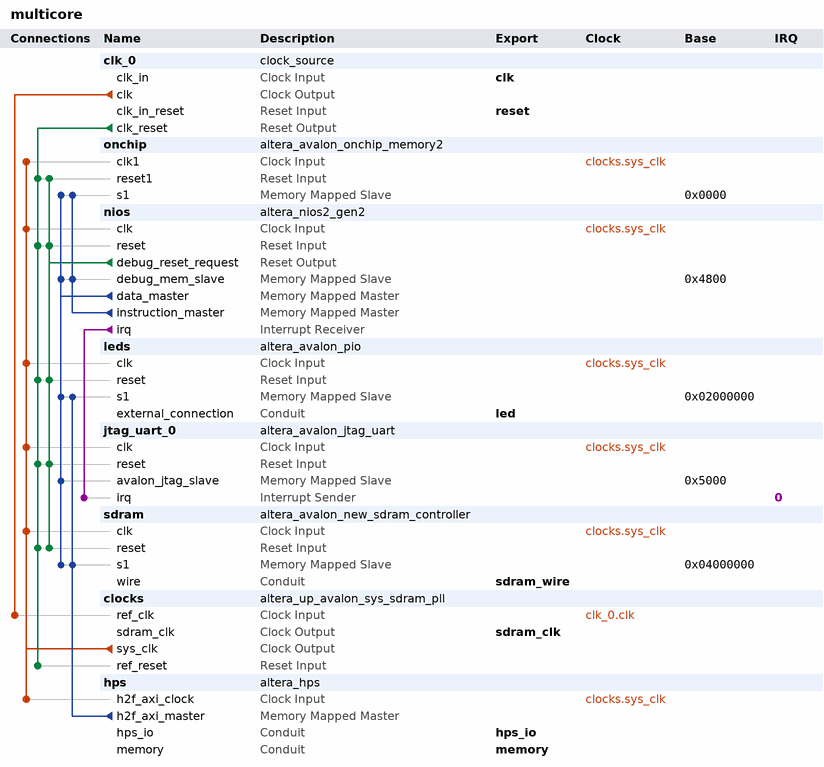
[diagram p0: system contents]
# Platform Designer (Qsys) system multicore, Cyclone V 5CSEMA5F31C6
# Parameters at their usual value, and those the tool derives, are not listed.
package require -exact qsys 16.1
create_system multicore
set_project_property DEVICE_FAMILY {Cyclone V}
set_project_property DEVICE 5CSEMA5F31C6

add_instance clk_0 clock_source 16.1
set_instance_parameter_value clk_0 clockFrequency 50000000

add_instance onchip altera_avalon_onchip_memory2 16.1
set_instance_parameter_value onchip dataWidth 32
set_instance_parameter_value onchip dualPort false
set_instance_parameter_value onchip initMemContent true
set_instance_parameter_value onchip initializationFileName onchip_mem.hex
set_instance_parameter_value onchip memorySize 16384

add_instance nios altera_nios2_gen2 16.1
set_instance_parameter_value nios dcache_size 2048
set_instance_parameter_value nios exceptionSlave onchip.s1
set_instance_parameter_value nios icache_size 4096
set_instance_parameter_value nios impl Tiny
set_instance_parameter_value nios resetSlave onchip.s1

add_instance leds altera_avalon_pio 16.1
set_instance_parameter_value leds direction Output
set_instance_parameter_value leds width 8

add_instance jtag_uart_0 altera_avalon_jtag_uart 16.1
set_instance_parameter_value jtag_uart_0 simInteractiveOptions NO_INTERACTIVE_WINDOWS

add_instance sdram altera_avalon_new_sdram_controller 16.1
set_instance_parameter_value sdram TAC 5.5
set_instance_parameter_value sdram TRCD 20.0
set_instance_parameter_value sdram TRP 20.0
set_instance_parameter_value sdram casLatency 3
set_instance_parameter_value sdram columnWidth 10
set_instance_parameter_value sdram dataWidth 16
set_instance_parameter_value sdram generateSimulationModel true
set_instance_parameter_value sdram model single_Micron_MT48LC4M32B2_7_chip
set_instance_parameter_value sdram numberOfBanks 4
set_instance_parameter_value sdram numberOfChipSelects 1
set_instance_parameter_value sdram powerUpDelay 100.0
set_instance_parameter_value sdram refreshPeriod 15.625
set_instance_parameter_value sdram rowWidth 13

add_instance clocks altera_up_avalon_sys_sdram_pll 16.1
set_instance_parameter_value clocks CV_boards DE1-SoC
set_instance_parameter_value clocks gui_outclk 50.0
set_instance_parameter_value clocks gui_refclk 50.0

add_instance hps altera_hps 16.1
set_instance_parameter_value hps CAN0_Mode CAN
set_instance_parameter_value hps CAN0_PinMuxing {HPS I/O Set 0}
set_instance_parameter_value hps EMAC1_Mode RGMII
set_instance_parameter_value hps EMAC1_PinMuxing {HPS I/O Set 0}
set_instance_parameter_value hps F2SCLK_COLDRST_Enable false
set_instance_parameter_value hps F2SCLK_DBGRST_Enable false
set_instance_parameter_value hps F2SCLK_WARMRST_Enable false
set_instance_parameter_value hps F2SINTERRUPT_Enable true
set_instance_parameter_value hps F2S_Width 0
set_instance_parameter_value hps FPGA_PERIPHERAL_OUTPUT_CLOCK_FREQ_EMAC0_GTX_CLK 125
set_instance_parameter_value hps FPGA_PERIPHERAL_OUTPUT_CLOCK_FREQ_EMAC0_MD_CLK 2.5
set_instance_parameter_value hps FPGA_PERIPHERAL_OUTPUT_CLOCK_FREQ_EMAC1_GTX_CLK 125
set_instance_parameter_value hps FPGA_PERIPHERAL_OUTPUT_CLOCK_FREQ_EMAC1_MD_CLK 2.5
set_instance_parameter_value hps HPS_PROTOCOL DDR3
set_instance_parameter_value hps I2C0_Mode I2C
set_instance_parameter_value hps I2C0_PinMuxing {HPS I/O Set 1}
set_instance_parameter_value hps I2C1_Mode N/A
set_instance_parameter_value hps I2C1_PinMuxing Unused
set_instance_parameter_value hps LWH2F_Enable false
set_instance_parameter_value hps MEM_BANKADDR_WIDTH 3
set_instance_parameter_value hps MEM_CLK_FREQ 400.0
set_instance_parameter_value hps MEM_COL_ADDR_WIDTH 10
set_instance_parameter_value hps MEM_DQ_WIDTH 40
set_instance_parameter_value hps MEM_DRV_STR RZQ/6
set_instance_parameter_value hps MEM_ROW_ADDR_WIDTH 15
set_instance_parameter_value hps MEM_RTT_NOM RZQ/6
set_instance_parameter_value hps MEM_RTT_WR {Dynamic ODT off}
set_instance_parameter_value hps MEM_TCL 7
set_instance_parameter_value hps MEM_TFAW_NS 30.0
set_instance_parameter_value hps MEM_TRAS_NS 35.0
set_instance_parameter_value hps MEM_TRCD_NS 13.75
set_instance_parameter_value hps MEM_TRFC_NS 260.0
set_instance_parameter_value hps MEM_TRP_NS 13.75
set_instance_parameter_value hps MEM_TRRD_NS 10.0
set_instance_parameter_value hps MEM_TRTP_NS 10.0
set_instance_parameter_value hps MEM_VENDOR JEDEC
set_instance_parameter_value hps MEM_WTCL 6
set_instance_parameter_value hps QSPI_Mode {1 SS}
set_instance_parameter_value hps QSPI_PinMuxing {HPS I/O Set 0}
set_instance_parameter_value hps REF_CLK_FREQ 25.0
set_instance_parameter_value hps S2FCLK_USER2CLK 5
set_instance_parameter_value hps S2F_Width 1
set_instance_parameter_value hps SDIO_Mode {4-bit Data}
set_instance_parameter_value hps SDIO_PinMuxing {HPS I/O Set 0}
set_instance_parameter_value hps SPIM0_Mode {Single Slave Select}
set_instance_parameter_value hps SPIM0_PinMuxing {HPS I/O Set 0}
set_instance_parameter_value hps SPIM1_Mode N/A
set_instance_parameter_value hps SPIM1_PinMuxing Unused
set_instance_parameter_value hps STM_Enable false
set_instance_parameter_value hps TIMING_BOARD_AC_SKEW 0.02
set_instance_parameter_value hps TIMING_BOARD_AC_TO_CK_SKEW 0.0
set_instance_parameter_value hps TIMING_BOARD_DQ_TO_DQS_SKEW 0.0
set_instance_parameter_value hps TIMING_BOARD_MAX_CK_DELAY 0.6
set_instance_parameter_value hps TIMING_BOARD_MAX_DQS_DELAY 0.6
set_instance_parameter_value hps TIMING_BOARD_SKEW_BETWEEN_DQS 0.02
set_instance_parameter_value hps TIMING_BOARD_SKEW_CKDQS_DIMM_MAX 0.01
set_instance_parameter_value hps TIMING_BOARD_SKEW_CKDQS_DIMM_MIN -0.01
set_instance_parameter_value hps TIMING_BOARD_SKEW_WITHIN_DQS 0.02
set_instance_parameter_value hps TIMING_TDH 45
set_instance_parameter_value hps TIMING_TDQSCK 225
set_instance_parameter_value hps TIMING_TDQSQ 100
set_instance_parameter_value hps TIMING_TDQSS 0.27
set_instance_parameter_value hps TIMING_TDS 10
set_instance_parameter_value hps TIMING_TDSH 0.18
set_instance_parameter_value hps TIMING_TDSS 0.18
set_instance_parameter_value hps TIMING_TIH 120
set_instance_parameter_value hps TIMING_TIS 170
set_instance_parameter_value hps TIMING_TQSH 0.4
set_instance_parameter_value hps TRACE_Mode HPS
set_instance_parameter_value hps TRACE_PinMuxing {HPS I/O Set 0}
set_instance_parameter_value hps UART0_Mode {No Flow Control}
set_instance_parameter_value hps UART0_PinMuxing {HPS I/O Set 2}
set_instance_parameter_value hps USB1_Mode SDR
set_instance_parameter_value hps USB1_PinMuxing {HPS I/O Set 0}
set_instance_parameter_value hps desired_cfg_clk_mhz 100.0
set_instance_parameter_value hps desired_qspi_clk_mhz 400.0

# connections
add_connection clk_0.clk clocks.ref_clk clock
add_connection clocks.sys_clk hps.h2f_axi_clock clock
add_connection clocks.sys_clk jtag_uart_0.clk clock
add_connection clocks.sys_clk leds.clk clock
add_connection clocks.sys_clk nios.clk clock
add_connection clocks.sys_clk onchip.clk1 clock
add_connection clocks.sys_clk sdram.clk clock
add_connection clk_0.clk_reset clocks.ref_reset reset
add_connection clk_0.clk_reset jtag_uart_0.reset reset
add_connection clk_0.clk_reset leds.reset reset
add_connection clk_0.clk_reset nios.reset reset
add_connection clk_0.clk_reset onchip.reset1 reset
add_connection clk_0.clk_reset sdram.reset reset
add_connection nios.debug_reset_request jtag_uart_0.reset reset
add_connection nios.debug_reset_request leds.reset reset
add_connection nios.debug_reset_request nios.reset reset
add_connection nios.debug_reset_request onchip.reset1 reset
add_connection nios.debug_reset_request sdram.reset reset
add_connection hps.h2f_axi_master leds.s1 avalon
set_connection_parameter_value hps.h2f_axi_master/leds.s1 baseAddress 0x02000000
add_connection hps.h2f_axi_master sdram.s1 avalon
set_connection_parameter_value hps.h2f_axi_master/sdram.s1 baseAddress 0x04000000
add_connection nios.data_master jtag_uart_0.avalon_jtag_slave avalon
set_connection_parameter_value nios.data_master/jtag_uart_0.avalon_jtag_slave baseAddress 0x5000
add_connection nios.data_master leds.s1 avalon
set_connection_parameter_value nios.data_master/leds.s1 baseAddress 0x02000000
add_connection nios.data_master nios.debug_mem_slave avalon
set_connection_parameter_value nios.data_master/nios.debug_mem_slave baseAddress 0x4800
add_connection nios.data_master onchip.s1 avalon
set_connection_parameter_value nios.data_master/onchip.s1 baseAddress 0x0000
add_connection nios.data_master sdram.s1 avalon
set_connection_parameter_value nios.data_master/sdram.s1 baseAddress 0x04000000
add_connection nios.instruction_master nios.debug_mem_slave avalon
set_connection_parameter_value nios.instruction_master/nios.debug_mem_slave baseAddress 0x4800
add_connection nios.instruction_master onchip.s1 avalon
set_connection_parameter_value nios.instruction_master/onchip.s1 baseAddress 0x0000
add_connection nios.irq jtag_uart_0.irq interrupt
set_connection_parameter_value nios.irq/jtag_uart_0.irq irqNumber 0

# exported interfaces
add_interface clk clock sink
set_interface_property clk EXPORT_OF clk_0.clk_in
add_interface hps_io conduit end
set_interface_property hps_io EXPORT_OF hps.hps_io
add_interface led conduit end
set_interface_property led EXPORT_OF leds.external_connection
add_interface memory conduit end
set_interface_property memory EXPORT_OF hps.memory
add_interface reset reset sink
set_interface_property reset EXPORT_OF clk_0.clk_in_reset
add_interface sdram_clk clock source
set_interface_property sdram_clk EXPORT_OF clocks.sdram_clk
add_interface sdram_wire conduit end
set_interface_property sdram_wire EXPORT_OF sdram.wire

set_interconnect_requirement {$system} qsys_mm.clockCrossingAdapter HANDSHAKE
set_interconnect_requirement {$system} qsys_mm.enableEccProtection FALSE
set_interconnect_requirement {$system} qsys_mm.insertDefaultSlave FALSE
set_interconnect_requirement {$system} qsys_mm.maxAdditionalLatency 1

save_system multicore.qsys
